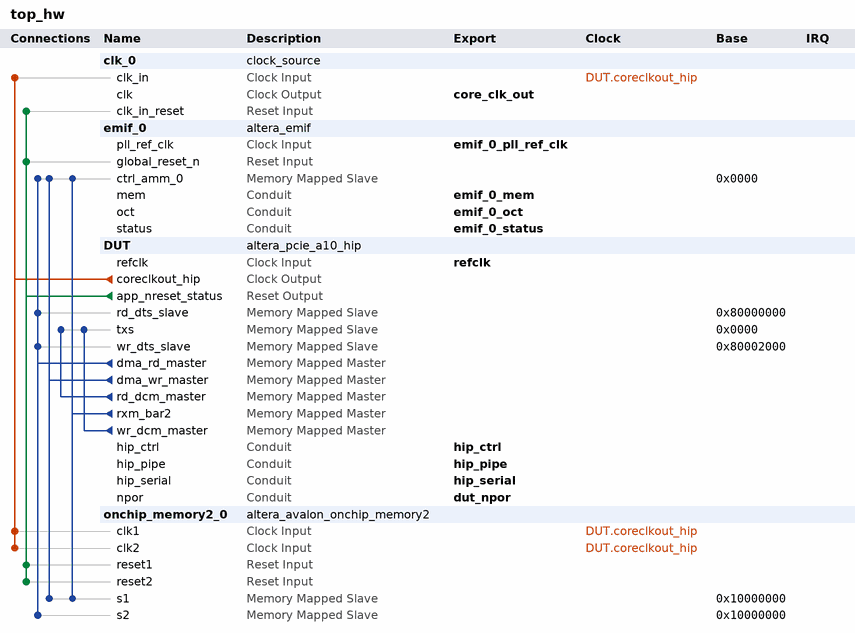
[diagram p0: system contents]
# Platform Designer (Qsys) system top_hw, Arria 10 10AX115S2F45I1SG
# Parameters at their usual value, and those the tool derives, are not listed.
package require -exact qsys 1.0
create_system top_hw
set_project_property DEVICE_FAMILY {Arria 10}
set_project_property DEVICE 10AX115S2F45I1SG

add_component clk_0 ip/top_hw/top_clk_0.ip clock_source clk_0 

add_component emif_0 ip/top_hw/top_emif_0.ip altera_emif emif_0 18.0

add_component DUT ip/top_hw/top_DUT.ip altera_pcie_a10_hip DUT 18.0

add_component onchip_memory2_0 ip/top_hw/top_onchip_memory2_0.ip altera_avalon_onchip_memory2 onchip_memory2_0 18.0

# connections
add_connection DUT.coreclkout_hip clk_0.clk_in clock
add_connection DUT.coreclkout_hip onchip_memory2_0.clk1 clock
add_connection DUT.coreclkout_hip onchip_memory2_0.clk2 clock
add_connection DUT.app_nreset_status clk_0.clk_in_reset reset
add_connection DUT.app_nreset_status emif_0.global_reset_n reset
add_connection DUT.app_nreset_status onchip_memory2_0.reset1 reset
add_connection DUT.app_nreset_status onchip_memory2_0.reset2 reset
add_connection DUT.dma_rd_master DUT.rd_dts_slave avalon
set_connection_parameter_value DUT.dma_rd_master/DUT.rd_dts_slave baseAddress 0x80000000
add_connection DUT.dma_rd_master DUT.wr_dts_slave avalon
set_connection_parameter_value DUT.dma_rd_master/DUT.wr_dts_slave baseAddress 0x80002000
add_connection DUT.dma_rd_master emif_0.ctrl_amm_0 avalon
set_connection_parameter_value DUT.dma_rd_master/emif_0.ctrl_amm_0 baseAddress 0x0000
add_connection DUT.dma_rd_master onchip_memory2_0.s2 avalon
set_connection_parameter_value DUT.dma_rd_master/onchip_memory2_0.s2 baseAddress 0x10000000
add_connection DUT.dma_wr_master emif_0.ctrl_amm_0 avalon
set_connection_parameter_value DUT.dma_wr_master/emif_0.ctrl_amm_0 baseAddress 0x0000
add_connection DUT.dma_wr_master onchip_memory2_0.s1 avalon
set_connection_parameter_value DUT.dma_wr_master/onchip_memory2_0.s1 baseAddress 0x10000000
add_connection DUT.rd_dcm_master DUT.txs avalon
set_connection_parameter_value DUT.rd_dcm_master/DUT.txs baseAddress 0x0000
add_connection DUT.rxm_bar2 emif_0.ctrl_amm_0 avalon
set_connection_parameter_value DUT.rxm_bar2/emif_0.ctrl_amm_0 baseAddress 0x0000
add_connection DUT.rxm_bar2 onchip_memory2_0.s1 avalon
set_connection_parameter_value DUT.rxm_bar2/onchip_memory2_0.s1 baseAddress 0x10000000
add_connection DUT.wr_dcm_master DUT.txs avalon
set_connection_parameter_value DUT.wr_dcm_master/DUT.txs baseAddress 0x0000

# exported interfaces
add_interface core_clk_out clock source
set_interface_property core_clk_out EXPORT_OF clk_0.clk
add_interface dut_npor conduit end
set_interface_property dut_npor EXPORT_OF DUT.npor
add_interface emif_0_mem conduit end
set_interface_property emif_0_mem EXPORT_OF emif_0.mem
add_interface emif_0_oct conduit end
set_interface_property emif_0_oct EXPORT_OF emif_0.oct
add_interface emif_0_pll_ref_clk clock sink
set_interface_property emif_0_pll_ref_clk EXPORT_OF emif_0.pll_ref_clk
add_interface emif_0_status conduit end
set_interface_property emif_0_status EXPORT_OF emif_0.status
add_interface hip_ctrl conduit end
set_interface_property hip_ctrl EXPORT_OF DUT.hip_ctrl
add_interface hip_pipe conduit end
set_interface_property hip_pipe EXPORT_OF DUT.hip_pipe
add_interface hip_serial conduit end
set_interface_property hip_serial EXPORT_OF DUT.hip_serial
add_interface refclk clock sink
set_interface_property refclk EXPORT_OF DUT.refclk

set_interconnect_requirement {$system} qsys_mm.clockCrossingAdapter FIFO
set_interconnect_requirement {$system} qsys_mm.maxAdditionalLatency 4

save_system top_hw.qsys
